# EAGLE design W706X (EAGLE 4.11)
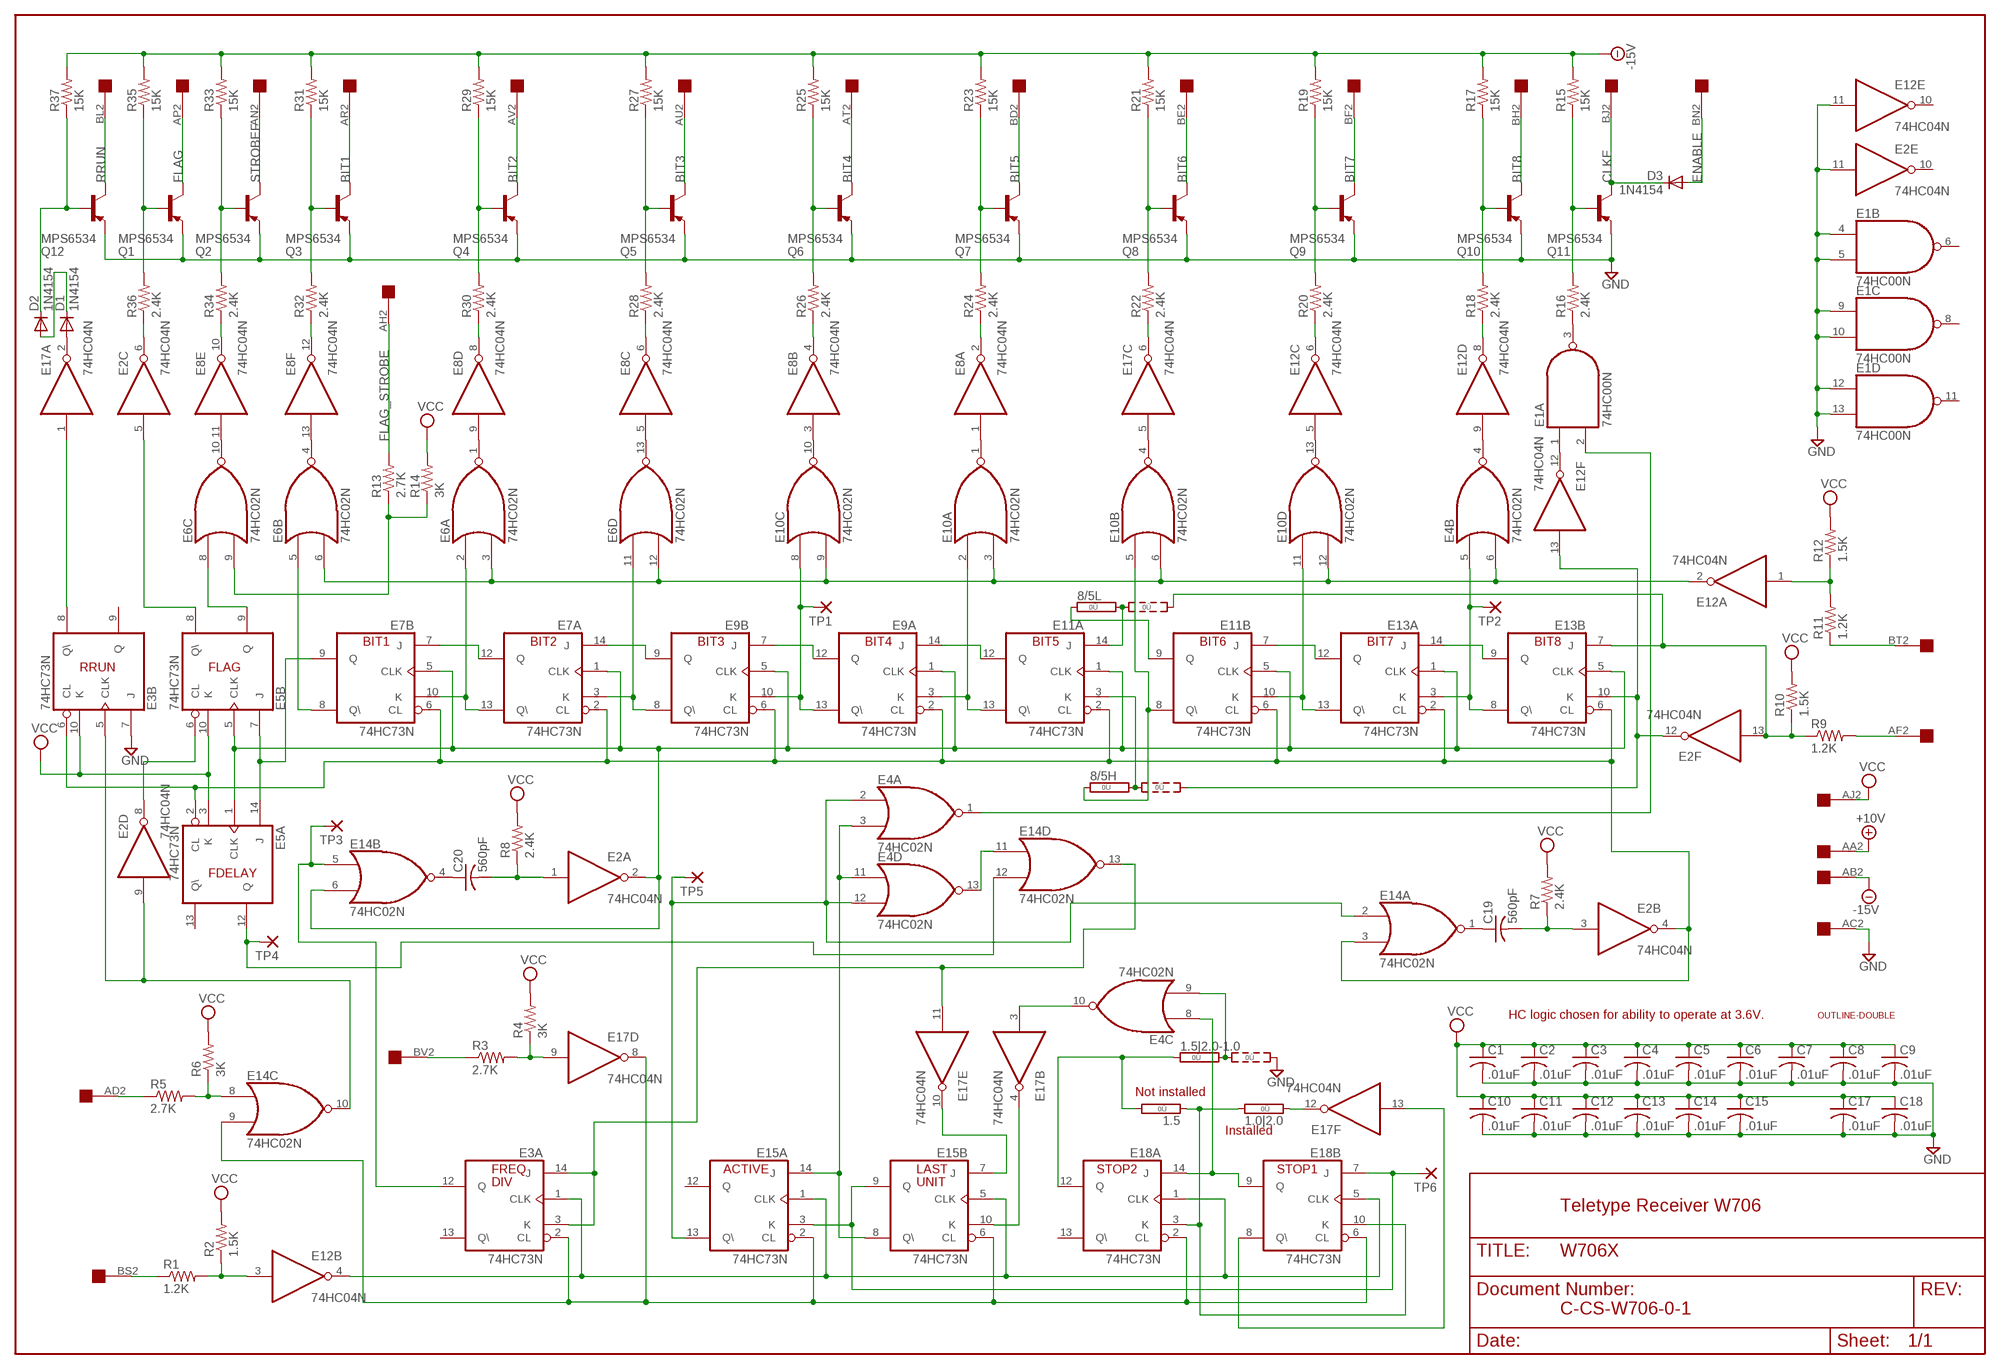
[diagram p0: schematic, sheet 1]

## Parts
1.0|2.0  0R  [0R/10]
1.5  0R  [0R/10]
1.5|2.0-1.0  0R2  [0R2/10]
8/5H  0R2  [0R2/10]
8/5L  0R2  [0R2/10]
C1  .01uF  C-US050-025X075  [C050-025X075]
C2  .01uF  C-US050-025X075  [C050-025X075]
C3  .01uF  C-US050-025X075  [C050-025X075]
C4  .01uF  C-US050-025X075  [C050-025X075]
C5  .01uF  C-US050-025X075  [C050-025X075]
C6  .01uF  C-US050-025X075  [C050-025X075]
C7  .01uF  C-US050-025X075  [C050-025X075]
C8  .01uF  C-US050-025X075  [C050-025X075]
C9  .01uF  C-US050-025X075  [C050-025X075]
C10  .01uF  C-US050-025X075  [C050-025X075]
C11  .01uF  C-US050-025X075  [C050-025X075]
C12  .01uF  C-US050-025X075  [C050-025X075]
C13  .01uF  C-US050-025X075  [C050-025X075]
C14  .01uF  C-US050-025X075  [C050-025X075]
C15  .01uF  C-US050-025X075  [C050-025X075]
C17  .01uF  C-US050-025X075  [C050-025X075]
C18  .01uF  C-US050-025X075  [C050-025X075]
C19  560pF  C-US050-025X075  [C050-025X075]
C20  560pF  C-US050-025X075  [C050-025X075]
D1  1N4154  1N4148  [DO35-10]
D2  1N4154  1N4148  [DO35-10]
D3  1N4154  1N4148  [DO35-10]
E1  74HC00N  74LS00N  [DIL14]
E2  74HC04N  74LS04N  [DIL14]
E3  74HC73N  74LS73N  [DIL14]
E4  74HC02N  74LS02N  [DIL14]
E5  74HC73N  74LS73N  [DIL14]
E6  74HC02N  74LS02N  [DIL14]
E7  74HC73N  74LS73N  [DIL14]
E8  74HC04N  74LS04N  [DIL14]
E9  74HC73N  74LS73N  [DIL14]
E10  74HC02N  74LS02N  [DIL14]
E11  74HC73N  74LS73N  [DIL14]
E12  74HC04N  74LS04N  [DIL14]
E13  74HC73N  74LS73N  [DIL14]
E14  74HC02N  74LS02N  [DIL14]
E15  74HC73N  74LS73N  [DIL14]
E17  74HC04N  74LS04N  [DIL14]
E18  74HC73N  74LS73N  [DIL14]
Q1  MPS6534  2N2904  [TO39]
Q2  MPS6534  2N2904  [TO39]
Q3  MPS6534  2N2904  [TO39]
Q4  MPS6534  2N2904  [TO39]
Q5  MPS6534  2N2904  [TO39]
Q6  MPS6534  2N2904  [TO39]
Q7  MPS6534  2N2904  [TO39]
Q8  MPS6534  2N2904  [TO39]
Q9  MPS6534  2N2904  [TO39]
Q10  MPS6534  2N2904  [TO39]
Q11  MPS6534  2N2904  [TO39]
Q12  MPS6534  2N2904  [TO39]
R1  1.2K  R-US_0207/10  [0207/10]
R2  1.5K  R-US_0207/10  [0207/10]
R3  2.7K  R-US_0207/10  [0207/10]
R4  3K  R-US_0207/10  [0207/10]
R5  2.7K  R-US_0207/10  [0207/10]
R6  3K  R-US_0207/10  [0207/10]
R7  2.4K  R-US_0207/10  [0207/10]
R8  2.4K  R-US_0207/10  [0207/10]
R9  1.2K  R-US_0207/10  [0207/10]
R10  1.5K  R-US_0207/10  [0207/10]
R11  1.2K  R-US_0207/10  [0207/10]
R12  1.5K  R-US_0207/10  [0207/10]
R13  2.7K  R-US_0207/10  [0207/10]
R14  3K  R-US_0207/10  [0207/10]
R15  15K  R-US_0207/10  [0207/10]
R16  2.4K  R-US_0207/10  [0207/10]
R17  15K  R-US_0207/10  [0207/10]
R18  2.4K  R-US_0207/10  [0207/10]
R19  15K  R-US_0207/10  [0207/10]
R20  2.4K  R-US_0207/10  [0207/10]
R21  15K  R-US_0207/10  [0207/10]
R22  2.4K  R-US_0207/10  [0207/10]
R23  15K  R-US_0207/10  [0207/10]
R24  2.4K  R-US_0207/10  [0207/10]
R25  15K  R-US_0207/10  [0207/10]
R26  2.4K  R-US_0207/10  [0207/10]
R27  15K  R-US_0207/10  [0207/10]
R28  2.4K  R-US_0207/10  [0207/10]
R29  15K  R-US_0207/10  [0207/10]
R30  2.4K  R-US_0207/10  [0207/10]
R31  15K  R-US_0207/10  [0207/10]
R32  2.4K  R-US_0207/10  [0207/10]
R33  15K  R-US_0207/10  [0207/10]
R34  2.4K  R-US_0207/10  [0207/10]
R35  15K  R-US_0207/10  [0207/10]
R36  2.4K  R-US_0207/10  [0207/10]
R37  15K  R-US_0207/10  [0207/10]
TP1  3,17/1,3  [3,17/1,3]
TP2  3,17/1,3  [3,17/1,3]
TP3  3,17/1,3  [3,17/1,3]
TP4  3,17/1,3  [3,17/1,3]
TP5  3,17/1,3  [3,17/1,3]
TP6  3,17/1,3  [3,17/1,3]
U$1  OUTLINE-DOUBLE  [DOUBLE]
U$2  DOUBLE  [EDGE-CON4]

## Nets
+10V [Supply]: U$2.AA2
-15V [Supply]: R15.2 R17.2 R19.2 R21.2 R23.2 R25.2 R27.2 R29.2 R31.2 R33.2 R35.2 R37.2 U$2.AB2
BIT1: Q3.3(C) U$2.AR2
BIT2: Q4.3(C) U$2.AV2
BIT3: Q5.3(C) U$2.AU2
BIT4: Q6.3(C) U$2.AT2
BIT5: Q7.3(C) U$2.BD2
BIT6: Q8.3(C) U$2.BE2
BIT7: Q9.3(C) U$2.BF2
BIT8: Q10.3(C) U$2.BH2
CLKE: D3.C Q11.3(C) U$2.BJ2
ENABLE: D3.A U$2.BN2
FLAG: Q1.3(C) U$2.AP2
FLAG_STROBE: R13.2 U$2.AH2
GND [Supply]: 1.5|2.0-1.0.3 C1.2 C2.2 C3.2 C4.2 C5.2 C6.2 C7.2 C8.2 C9.2 C10.2 C11.2 C12.2 C13.2 C14.2 C15.2 C17.2 C18.2 E1.4(B:I0) E1.5(B:I1) E1.9(C:I0) E1.10(C:I1) E1.12(D:I0) E1.13(D:I1) E2.11(E:I) E3.7(B:J) E12.11(E:I) Q1.1(E) Q2.1(E) Q3.1(E) Q4.1(E) Q5.1(E) Q6.1(E) Q7.1(E) Q8.1(E) Q9.1(E) Q10.1(E) Q11.1(E) Q12.1(E) U$2.AC2
N$1: E6.1(A:O) E8.9(D:I)
N$2: E6.4(B:O) E8.13(F:I)
N$3: E6.10(C:O) E8.11(E:I)
N$4: E6.13(D:O) E8.5(C:I)
N$5: E8.1(A:I) E10.1(A:O)
N$6: E10.4(B:O) E17.5(C:I)
N$7: E10.13(D:O) E12.5(C:I)
N$8: E8.3(B:I) E10.10(C:O)
N$9: E4.4(B:O) E12.9(D:I)
N$10: D1.A E17.2(A:O)
N$11: D1.C D2.A
N$12: D2.C Q12.2(B) R37.1
N$13: E1.3(A:O) R16.1
N$14: E12.8(D:O) R18.1
N$15: E12.6(C:O) R20.1
N$16: E17.6(C:O) R22.1
N$17: E8.2(A:O) R24.1
N$18: E8.4(B:O) R26.1
N$19: E8.6(C:O) R28.1
N$20: E8.8(D:O) R30.1
N$21: E8.12(F:O) R32.1
N$22: E2.6(C:O) R36.1
N$23: Q1.2(B) R35.1 R36.2
N$24: E8.10(E:O) R34.1
N$25: Q2.2(B) R33.1 R34.2
N$26: Q3.2(B) R31.1 R32.2
N$27: Q4.2(B) R29.1 R30.2
N$28: Q5.2(B) R27.1 R28.2
N$29: Q6.2(B) R25.1 R26.2
N$30: Q7.2(B) R23.1 R24.2
N$31: Q8.2(B) R21.1 R22.2
N$32: Q9.2(B) R19.1 R20.2
N$33: Q10.2(B) R17.1 R18.2
N$34: Q11.2(B) R15.1 R16.2
N$35: E3.8(B:Q\) E17.1(A:I)
N$36: E2.5(C:I) E5.8(B:Q\)
N$37: E5.9(B:Q) E6.8(C:I0)
N$38: E7.7(B:J) E7.12(A:Q)
N$39: E6.2(A:I0) E7.10(B:K) E7.13(A:Q\)
N$40: E2.2(A:O) E5.1(A:CLK) E5.5(B:CLK) E7.1(A:CLK) E7.5(B:CLK) E9.1(A:CLK) E9.5(B:CLK) E11.1(A:CLK) E11.5(B:CLK) E13.1(A:CLK) E13.5(B:CLK) E14.6(B:I1)
N$41: E2.4(B:O) E3.6(B:CL) E5.2(A:CL) E7.2(A:CL) E7.6(B:CL) E9.2(A:CL) E9.6(B:CL) E11.2(A:CL) E11.6(B:CL) E13.2(A:CL) E13.6(B:CL) E14.3(A:I1)
N$42: E6.11(D:I0) E7.3(A:K) E9.8(B:Q\)
N$43: E7.14(A:J) E9.9(B:Q)
N$44: E9.10(B:K) E9.13(A:Q\) E10.8(C:I0) TP1.1(P)
N$45: E9.7(B:J) E9.12(A:Q)
N$46: E10.11(D:I0) E11.10(B:K) E13.13(A:Q\)
N$47: E11.7(B:J) E13.12(A:Q)
N$48: E9.3(A:K) E10.2(A:I0) E11.13(A:Q\)
N$49: E9.14(A:J) E11.12(A:Q)
N$50: 8/5H.1 E10.5(B:I0) E11.8(B:Q\)
N$51: 8/5L.1 E11.9(B:Q)
N$52: E4.5(B:I0) E13.3(A:K) E13.8(B:Q\) TP2.1(P)
N$53: E13.9(B:Q) E13.14(A:J)
N$54: R1.1 U$2.BS2
N$55: E4.6(B:I1) E6.3(A:I1) E6.6(B:I1) E6.12(D:I1) E10.3(A:I1) E10.6(B:I1) E10.9(C:I1) E10.12(D:I1) E12.2(A:O)
N$56: E6.5(B:I0) E7.8(B:Q\)
N$57: E12.3(B:I) R1.2 R2.1
N$58: R11.1 U$2.BT2
N$59: E12.1(A:I) R11.2 R12.1
N$60: E4.3(A:I1) E4.11(D:I0) E15.8(B:Q\) E15.14(A:J)
N$61: E2.9(D:I) E3.5(B:CLK) E14.10(C:O)
N$62: E4.8(C:I0) E18.9(B:Q) E18.14(A:J)
N$63: E15.3(A:K) E15.9(B:Q) E18.7(B:J) TP6.1(P)
N$64: E1.2(A:I1) E4.1(A:O)
N$65: 8/5L.3 E2.13(F:I) E13.7(B:J) R9.1 R10.1
N$66: 8/5H.2 E11.3(A:K)
N$67: 8/5L.2 E11.14(A:J)
N$68: E14.8(C:I0) R5.2 R6.1
N$69: R9.2 U$2.AF2
N$70: 8/5H.3 E2.12(F:O) E12.13(F:I) E13.10(B:K)
N$71: E6.9(C:I1) R13.1 R14.1
N$72: R5.1 U$2.AD2
N$73: E4.2(A:I0) E4.12(D:I1) E14.2(A:I0) E15.13(A:Q\) TP5.1(P)
N$74: E2.8(D:O) E5.6(B:CL)
N$75: E3.1(A:CLK) E12.4(B:O) E15.1(A:CLK) E15.5(B:CLK) E18.1(A:CLK) E18.5(B:CLK)
N$76: 1.5|2.0-1.0.2 E4.9(C:I1)
N$77: E17.9(D:I) R3.2 R4.1
N$78: R3.1 U$2.BV2
N$79: E4.10(C:O) E17.3(B:I)
N$80: E3.2(A:CL) E14.9(C:I1) E15.2(A:CL) E15.6(B:CL) E17.8(D:O) E18.2(A:CL) E18.6(B:CL)
N$81: 1.0|2.0.2 1.5.1 E18.3(A:K) E18.10(B:K)
N$82: 1.5.2 1.5|2.0-1.0.1 E18.12(A:Q)
N$83: E15.10(B:K) E17.4(B:O)
N$84: E4.13(D:O) E14.11(D:I0)
N$85: C20.2 E2.1(A:I) R8.1
N$86: C19.2 E2.3(B:I) R7.1
N$87: C20.1 E14.4(B:O)
N$88: C19.1 E14.1(A:O)
N$89: 1.0|2.0.1 E17.12(F:O)
N$90: E17.13(F:I) E18.8(B:Q\)
N$91: E3.12(A:Q) E14.5(B:I0) TP3.1(P)
N$92: E5.7(B:J) E5.14(A:J) E7.9(B:Q)
N$93: E15.7(B:J) E17.10(E:O)
N$94: E5.12(A:Q) E14.12(D:I1) TP4.1(P)
N$95: E3.3(A:K) E3.14(A:J) E14.13(D:O) E17.11(E:I)
N$96: E1.1(A:I0) E12.12(F:O)
RRUN: Q12.3(C) U$2.BL2
STROBEF: Q2.3(C) U$2.AN2
VCC [Supply]: C1.1 C2.1 C3.1 C4.1 C5.1 C6.1 C7.1 C8.1 C9.1 C10.1 C11.1 C12.1 C13.1 C14.1 C15.1 C17.1 C18.1 E3.10(B:K) E5.3(A:K) E5.10(B:K) R2.2 R4.2 R6.2 R7.2 R8.2 R10.2 R12.2 R14.2 U$2.AJ2
Unconnected: E1.6(B:O) E1.8(C:O) E1.11(D:O) E2.10(E:O) E3.9(B:Q) E3.13(A:Q\) E5.13(A:Q\) E12.10(E:O) E15.12(A:Q) E18.13(A:Q\) U$2.AA1 U$2.AB1 U$2.AC1 U$2.AD1 U$2.AE1 U$2.AE2 U$2.AF1 U$2.AH1 U$2.AJ1 U$2.AK1 U$2.AK2 U$2.AL1 U$2.AL2 U$2.AM1 U$2.AM2 U$2.AN1 U$2.AP1 U$2.AR1 U$2.AS1 U$2.AS2 U$2.AT1 U$2.AU1 U$2.AV1 U$2.BA1 U$2.BA2 U$2.BB1 U$2.BB2 U$2.BC1 U$2.BC2 U$2.BD1 U$2.BE1 U$2.BF1 U$2.BH1 U$2.BJ1 U$2.BK1 U$2.BK2 U$2.BL1 U$2.BM1 U$2.BM2 U$2.BN1 U$2.BP1 U$2.BP2 U$2.BR1 U$2.BR2 U$2.BS1 U$2.BT1 U$2.BU1 U$2.BU2 U$2.BV1

## Notes on the sheet
- BIT1 | BIT2 | BIT3 | BIT4 | BIT5 | BIT6 | BIT7 | BIT8
- RRUN | FLAG
- FDELAY
- HC logic chosen for ability to operate at 3.6V.
- Not installed
- Installed
- FREQ | ACTIVE | LAST | STOP2 | STOP1
- DIV | UNIT
- Teletype Receiver W706
- C-CS-W706-0-1

## Power pins joined to a net without a drawn wire
GND: E1.7(P:GND) E2.7(P:GND) E3.11(P:GND) E4.7(P:GND) E5.11(P:GND) E6.7(P:GND) E7.11(P:GND) E8.7(P:GND) E9.11(P:GND) E10.7(P:GND) E11.11(P:GND) E12.7(P:GND) E13.11(P:GND) E14.7(P:GND) E15.11(P:GND) E17.7(P:GND) E18.11(P:GND)
VCC: E1.14(P:VCC) E2.14(P:VCC) E3.4(P:VCC) E4.14(P:VCC) E5.4(P:VCC) E6.14(P:VCC) E7.4(P:VCC) E8.14(P:VCC) E9.4(P:VCC) E10.14(P:VCC) E11.4(P:VCC) E12.14(P:VCC) E13.4(P:VCC) E14.14(P:VCC) E15.4(P:VCC) E17.14(P:VCC) E18.4(P:VCC)

## Library data of the parts
1.0|2.0 1.5 = jumper:0R: Bridge 0R 10mm
1.5|2.0-1.0 8/5H 8/5L = jumper:0R2: Bridge switch 0R 2 x 10mm
C1-C15 C17-C20 = rcl:C-US: CAPACITOR, American symbol
D1-D3 = diode:1N4148: DIODE high speed (Philips)
E1 = 74xx-us:74*00: Quad 2-input NAND gate
E2 E8 E12 E17 = 74xx-us:74*04: Hex INVERTER
E3 E5 E7 E9 E11 E13 E15 E18 = 74xx-us:74*73: Dual J-K FLIP FLOP, clear
E4 E6 E10 E14 = 74xx-us:74*02: Quad 2-input NOR gate
Q1-Q12 = transistor-pnp:2N2904*: PNP Transistror
R1-R37 = rcl:R-US_: RESISTOR, American symbol
TP1-TP6 = wirepad:3,17/1,3: THROUGH-HOLE PAD
U$1 = dec-con:OUTLINE-*: Board outlines for DEC boards.
U$2 = dec-con:DOUBLE: Double-Height DEC board

## Net classes
1 Supply: width 0.813 mm

## Board
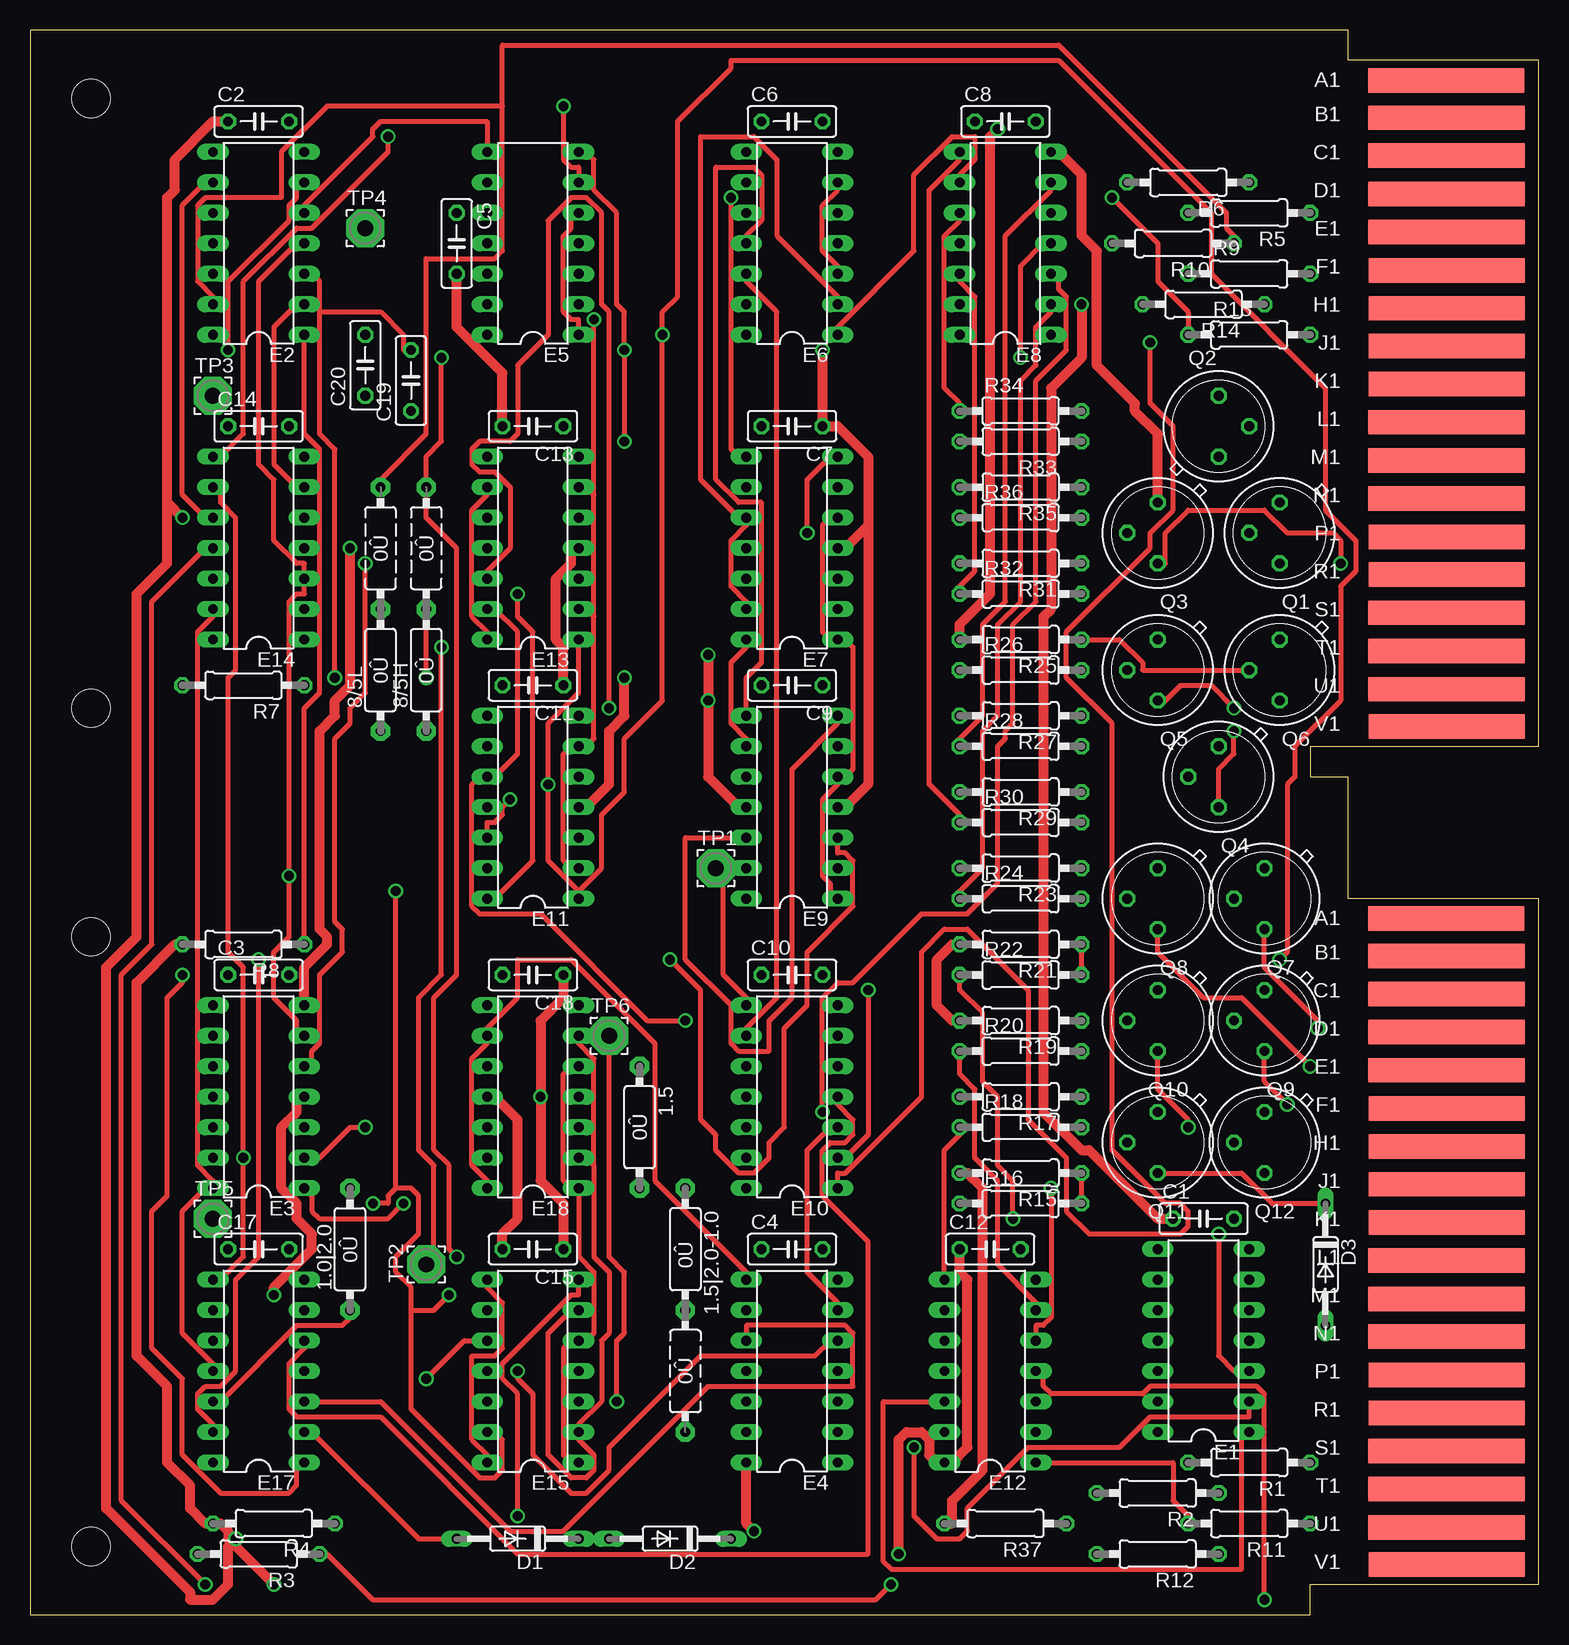
[diagram p1: board, top side]
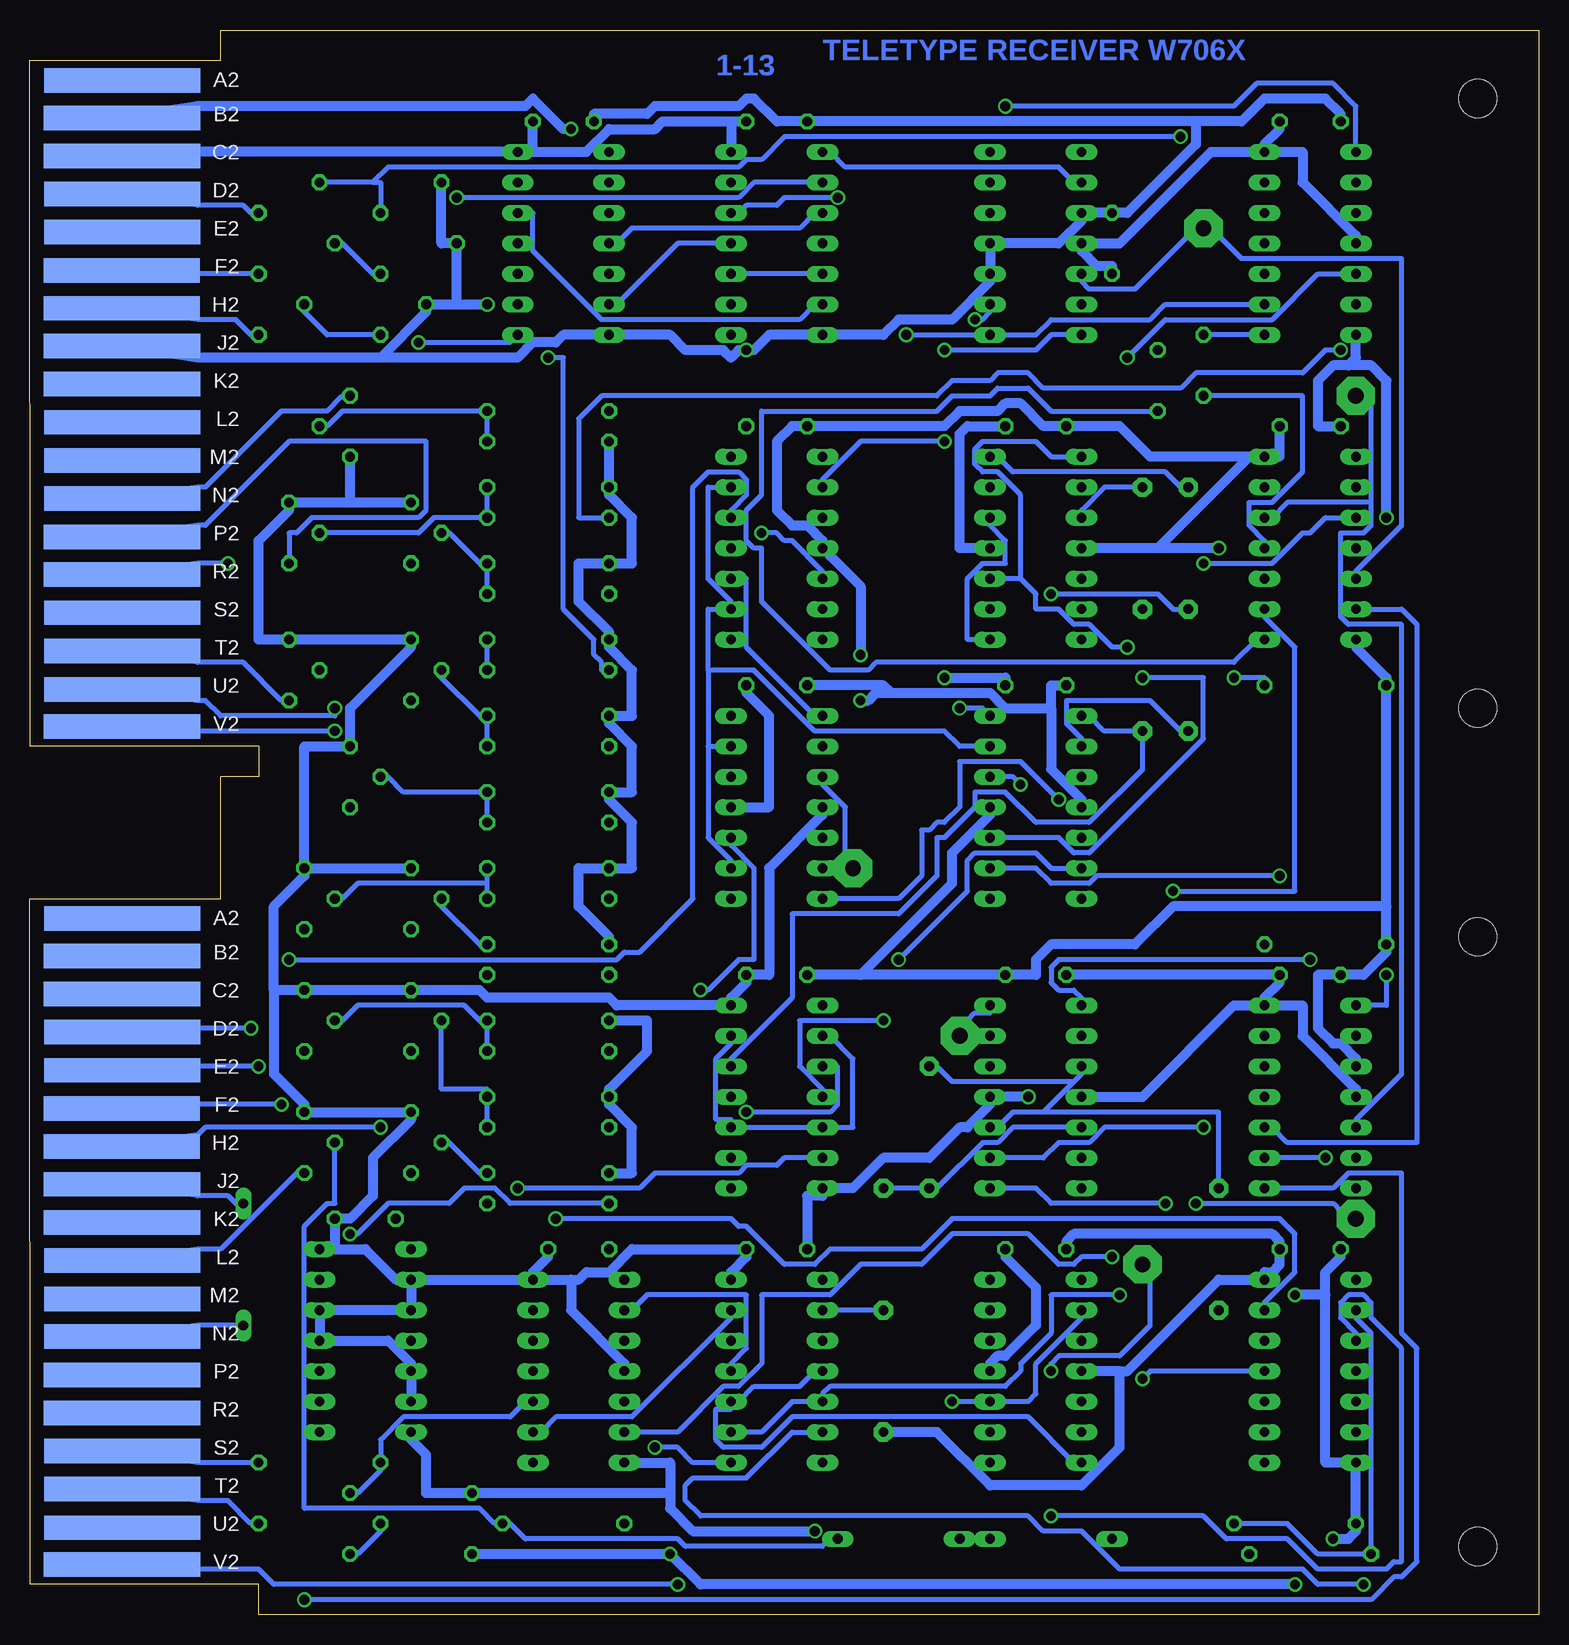
[diagram p2: board, bottom side, seen from below]

Size 125.73 x 132.08 mm. Coordinates in mm from the lower left corner, seen from the top.
Copper layers (1+16): Top 0.035mm / dielectric 1.5mm / Bottom 0.035mm
Design rules "16mils": minimum track width 16mil, minimum drill 32mil, track to track 15mil, track to pad 10mil, pad to pad 10mil, via to via 10mil, smd to smd 10mil, copper to edge 25mil, drill to drill 10mil, minimum pad ring 10mil, minimum via ring 8mil, stop-mask expansion 0mil, vias tented up to drill 0mil, thermal gap 10mil

### Footprints (pad centres in the part's own frame; a part is rotated, then mirrored left to right if it is on the bottom)
0R/10 = drill 0.813 pad 1.6 octagon: 1 -5.08,0; 2 5.08,0
0R2/10 = drill 0.813 pad 1.6 octagon: 1 -5.08,0; 2 5.08,0; 3 15.24,0
C050-025X075 = drill 0.813 octagon: 1 -2.54,0; 2 2.54,0
DO35-10 = drill 0.813 long: A 5.08,0; C -5.08,0
DIL14 = drill 0.813 long: 1 -7.62,-3.81; 2 -5.08,-3.81; 3 -2.54,-3.81; 4 0,-3.81; 5 2.54,-3.81; 6 5.08,-3.81; 7 7.62,-3.81; 8 7.62,3.81; 9 5.08,3.81; 10 2.54,3.81; 11 0,3.81; 12 -2.54,3.81; 13 -5.08,3.81; 14 -7.62,3.81
TO39 = drill 0.813 octagon: 1 0,-2.54; 2 2.54,0; 3 0,2.54
0207/10 = drill 0.813 octagon: 1 -5.08,0; 2 5.08,0
3,17/1,3 = drill 1.321 pad 3.175 octagon: 1 0,0
DOUBLE = hole 3.175: 120.65,56.515; 120.65,5.715; 120.65,75.565; 120.65,126.365
EDGE-CON4 = smd 13.017 x 2.032: AA1 7.709,4.207; AB1 7.684,7.312; AC1 7.684,10.474; AD1 7.684,13.665; AE1 7.693,16.84; AF1 7.668,20.041; AH1 7.668,23.19; AJ1 7.668,26.34; AK1 7.668,29.515; AL1 7.693,32.69; AM1 7.693,35.89; AN1 7.693,39.04; AP1 7.668,42.24; AR1 7.668,45.39; AS1 7.693,48.565; AT1 7.693,51.74; AU1 7.693,54.94; AV1 7.668,58.026; BA1 7.709,74.057; BB1 7.684,77.162; BC1 7.684,80.324; BD1 7.684,83.515; BE1 7.693,86.69; BF1 7.668,89.891; BH1 7.668,93.04; BJ1 7.668,96.19; BK1 7.668,99.365; BL1 7.693,102.54; BM1 7.693,105.74; BN1 7.693,108.89; BP1 7.668,112.09; BR1 7.668,115.24; BS1 7.693,118.415; BT1 7.693,121.59; BU1 7.693,124.79; BV1 7.668,127.876 | smd 13.017 x 2.032 bottom: AA2 7.69,4.207; AB2 7.668,7.328; AC2 7.668,10.49; AD2 7.693,13.665; AE2 7.693,16.84; AF2 7.642,20.041; AH2 7.642,23.19; AJ2 7.668,26.34; AK2 7.668,29.515; AL2 7.693,32.69; AM2 7.693,35.89; AN2 7.693,39.04; AP2 7.668,42.24; AR2 7.668,45.39; AS2 7.693,48.565; AT2 7.693,51.74; AU2 7.693,54.966; AV2 7.668,58.026; BA2 7.69,74.057; BB2 7.668,77.178; BC2 7.668,80.34; BD2 7.693,83.515; BE2 7.693,86.69; BF2 7.642,89.891; BH2 7.642,93.04; BJ2 7.668,96.19; BK2 7.668,99.365; BL2 7.693,102.54; BM2 7.693,105.74; BN2 7.693,108.89; BP2 7.668,112.09; BR2 7.668,115.24; BS2 7.693,118.415; BT2 7.693,121.59; BU2 7.693,124.816; BV2 7.668,127.876

### Placement (x,y rotation side)
1.0|2.0  26.67,30.48 90 top
1.5  50.8,40.64 270 top
1.5|2.0-1.0  54.61,30.48 270 top
8/5H  33.02,78.74 90 top
8/5L  29.21,78.74 90 top
C1  97.79,33.02 0 top
C2  19.05,124.46 0 top
C3  19.05,53.34 0 top
C4  63.5,30.48 0 top
C5  35.56,114.3 270 top
C6  63.5,124.46 0 top
C7  63.5,99.06 180 top
C8  81.28,124.46 0 top
C9  63.5,77.47 180 top
C10  63.5,53.34 0 top
C11  41.91,77.47 180 top
C12  80.01,30.48 0 top
C13  41.91,99.06 180 top
C14  19.05,99.06 0 top
C15  41.91,30.48 180 top
C17  19.05,30.48 0 top
C18  41.91,53.34 180 top
C19  31.75,102.87 90 top
C20  27.94,104.14 90 top
D1  40.64,6.35 180 top
D2  53.34,6.35 180 top
D3  107.95,29.21 270 top
E1  97.79,22.86 90 top
E2  19.05,114.3 90 top
E3  19.05,43.18 90 top
E4  63.5,20.32 90 top
E5  41.91,114.3 90 top
E6  63.5,114.3 90 top
E7  63.5,88.9 90 top
E8  81.28,114.3 90 top
E9  63.5,67.31 90 top
E10  63.5,43.18 90 top
E11  41.91,67.31 90 top
E12  80.01,20.32 90 top
E13  41.91,88.9 90 top
E14  19.05,88.9 90 top
E15  41.91,20.32 90 top
E17  19.05,20.32 90 top
E18  41.91,43.18 90 top
Q1  104.14,90.17 180 top
Q2  99.06,99.06 0 top
Q3  93.98,90.17 180 top
Q4  99.06,69.85 180 top
Q5  93.98,78.74 180 top
Q6  104.14,78.74 180 top
Q7  102.87,59.69 180 top
Q8  93.98,59.69 180 top
Q9  102.87,49.53 180 top
Q10  93.98,49.53 180 top
Q11  93.98,39.37 180 top
Q12  102.87,39.37 180 top
R1  101.6,12.7 180 top
R2  93.98,10.16 180 top
R3  19.05,5.08 180 top
R4  20.32,7.62 180 top
R5  101.6,116.84 180 top
R6  96.52,119.38 180 top
R7  17.78,77.47 180 top
R8  17.78,55.88 180 top
R9  101.6,111.76 0 top
R10  95.25,114.3 180 top
R11  101.6,7.62 180 top
R12  93.98,5.08 180 top
R13  101.6,106.68 0 top
R14  97.79,109.22 180 top
R15  82.55,36.83 180 top
R16  82.55,34.29 0 top
R17  82.55,43.18 180 top
R18  82.55,40.64 0 top
R19  82.55,49.53 180 top
R20  82.55,46.99 0 top
R21  82.55,55.88 180 top
R22  82.55,53.34 0 top
R23  82.55,62.23 180 top
R24  82.55,59.69 0 top
R25  82.55,81.28 180 top
R26  82.55,78.74 0 top
R27  82.55,74.93 180 top
R28  82.55,72.39 0 top
R29  82.55,68.58 180 top
R30  82.55,66.04 0 top
R31  82.55,87.63 180 top
R32  82.55,85.09 0 top
R33  82.55,97.79 180 top
R34  82.55,100.33 0 top
R35  82.55,93.98 180 top
R36  82.55,91.44 0 top
R37  81.28,7.62 180 top
TP1  57.15,62.23 0 top
TP2  33.02,29.21 90 top
TP3  15.24,101.6 0 top
TP4  27.94,115.57 0 top
TP5  15.24,33.02 0 top
TP6  48.26,48.26 0 top
U$1  125.73,132.08 180 top
U$2  125.73,132.08 180 top

### Tracks (layer width: path | path; a pad name or v marks a point on that pad's centre or on a via)
-15V  (via drill 0.81)
  Top 0.813: R37.2 76.83,7.62 76.83,9.53 79.38,12.06 79.38,35.56 78.11,36.83 R15.2 | v80.64,123.83 80.01,123.19 80.01,85.09 77.47,82.55 R25.2 | R19.2 76.83,49.53 75.56,50.8 75.56,54.61 76.83,55.88 R21.2
  Bottom 0.813: R19.2 74.3,49.53 74.3,46.99 77.47,43.81 R17.2 77.47,42.55 75.56,40.64 75.56,36.83 R15.2 | R33.2 R35.2 77.47,93.34 75.56,91.44 75.56,87.63 R31.2 80.01,87.63 80.01,84.45 77.47,81.92 R25.2 77.47,80.64 75.56,78.74 75.56,74.93 R27.2 77.47,74.3 75.56,72.39 75.56,68.58 R29.2 77.47,67.94 75.56,66.04 75.56,62.23 R23.2 80.01,62.23 80.01,59.05 77.47,56.52 R21.2 | v80.64,123.83 81.28,123.83 83.82,126.36 84.45,125.73 111.76,125.73 U$2.AB2
BIT1  (via drill 0.81)
  Top 0.406: v109.22,87.63 109.22,89.53 108.58,90.17 104.78,90.17 102.87,92.08 96.52,92.08 94.61,90.17 94.61,87.63 Q3.3
  Bottom 0.406: v109.22,87.63 111.76,87.63 U$2.AR2
BIT2  (via drill 0.81)
  Top 0.406: v100.33,73.66 100.33,71.75 99.06,70.48 Q4.3
  Bottom 0.406: v100.33,73.66 111.76,73.66 U$2.AV2
BIT3  (via drill 0.81)
  Top 0.406: v100.33,75.56 98.42,77.47 95.89,77.47 94.61,76.2 Q5.3
  Bottom 0.406: v100.33,75.56 100.33,74.93 109.86,74.93 111.12,76.2 111.76,76.2 U$2.AU2
BIT4
  Bottom 0.406: Q6.3 104.78,76.2 107.95,79.38 111.76,79.38 U$2.AT2
BIT5  (via drill 0.81)
  Top 0.406: v107.31,48.9 107.31,49.53 102.87,53.98 Q7.3
  Bottom 0.406: v107.31,48.9 111.76,48.9 U$2.BD2
BIT6  (via drill 0.81)
  Top 0.406: Q8.3 93.98,55.24 97.79,51.44 100.97,51.44 v106.68,45.72
  Bottom 0.406: v106.68,45.72 111.76,45.72 U$2.BE2
BIT7  (via drill 0.81)
  Top 0.406: v104.78,42.55 102.87,44.45 Q9.3
  Bottom 0.406: v104.78,42.55 111.76,42.55 U$2.BF2
BIT8  (via drill 0.81)
  Top 0.406: v96.52,40.64 96.52,41.27 93.98,43.81 Q10.3
  Bottom 0.406: v96.52,40.64 111.12,40.64 111.76,40.01 U$2.BH2
CLKE
  Top 0.406: Q11.3 100.97,36.83 103.5,34.29 D3.C
  Bottom 0.406: D3.C 108.58,34.29 109.22,34.92 111.76,34.92 U$2.BJ2
ENABLE
  Bottom 0.406: D3.A 111.76,24.13 U$2.BN2
FLAG
  Bottom 0.406: Q1.3 104.14,90.17 103.5,90.17 102.23,91.44 93.34,91.44 92.71,92.08 92.71,97.79 104.14,97.79 111.12,90.81 111.76,90.81 U$2.AP2
FLAG_STROBE
  Bottom 0.406: R13.2 107.31,106.68 108.58,107.95 111.76,107.95 U$2.AH2
GND  (via drill 0.81)
  Top 0.813: E18.11 38.73,43.18 40.64,41.27 40.64,33.02 39.37,31.75 C15.2 | C5.2 35.56,107.31 39.37,103.5 C13.2 | v26.67,88.9 26.67,77.47 25.4,76.2 25.4,74.93 24.13,73.66 24.13,57.15 24.77,56.52 24.77,55.88 22.86,53.98 E3.7 | E9.11 59.05,67.31 56.52,69.85 v56.52,76.2 v56.52,80.01 | E8.7 85.72,121.92 87.63,120.02 87.63,114.94 88.9,113.67 88.9,104.14 92.08,100.97 92.08,100.33 93.98,98.42 Q3.1
  Bottom 0.813: C18.2 C3.2 21.59,52.7 22.86,51.44 E3.7 | E3.11 15.24,43.81 19.68,48.26 19.68,50.8 E3.7 | E18.11 33.02,43.18 25.4,50.8 E3.7 | 34.92,20.32 34.29,20.32 26.67,27.94 E17.7 22.86,28.57 22.23,28.57 21.59,29.21 C17.2 21.59,31.11 22.23,31.75 38.73,31.75 39.37,31.11 C15.2 | 34.92,20.32 E15.11 | 34.92,20.32 34.92,13.97 38.1,10.79 45.72,10.79 50.16,15.24 1.5|2.0-1.0.3 | C5.2 35.56,112.39 36.83,112.39 38.1,113.67 E5.11 34.92,114.3 27.3,121.92 E2.7 | E2.11 15.24,114.94 19.68,119.38 19.68,121.92 E2.7 | C2.2 21.59,123.83 22.86,122.56 E2.7 | 31.75,88.9 24.13,96.52 | 31.75,88.9 E13.11 | 24.13,96.52 E14.7 21.59,96.52 C14.2 | 24.13,96.52 32.38,96.52 34.92,99.06 C13.2 41.27,99.06 43.18,100.97 44.45,100.97 45.09,100.33 48.26,100.33 49.53,99.06 C7.2 62.23,99.06 63.5,97.79 63.5,92.08 62.23,90.81 60.96,90.81 59.69,89.53 E7.11 59.05,88.9 59.05,88.27 56.52,85.72 v56.52,80.01 | v26.67,88.9 31.75,88.9 | 67.31,124.46 E6.7 | 67.31,124.46 C6.2 | U$2.AC2 111.76,121.92 E8.7 83.82,121.92 | 83.82,121.92 C8.2 | 67.31,124.46 73.03,124.46 73.66,123.83 77.47,123.83 79.38,121.92 83.82,121.92 | E1.13 E1.12 93.98,20.95 95.89,22.86 E1.4 E1.5 E1.10 E1.9 | 100.33,30.48 C1.2 99.06,33.02 97.16,34.92 97.16,38.1 93.98,41.27 Q11.1 Q12.1 102.87,42.55 105.41,45.09 105.41,52.07 | 100.33,30.48 E1.7 | E4.7 67.31,28.57 66.04,29.84 C4.2 75.56,30.48 77.47,28.57 79.38,28.57 80.01,27.94 80.64,27.94 | 80.64,27.94 80.64,25.4 76.2,20.95 E12.11 | E12.7 80.64,27.94 | C12.2 82.55,29.84 83.82,28.57 E12.7 | E1.9 E12.7 | 100.33,30.48 97.79,30.48 95.25,27.94 E1.9 | 99.06,92.71 Q3.1 | 99.06,92.71 Q1.1 104.14,92.08 106.68,89.53 106.68,81.28 Q6.1 Q5.1 93.98,80.64 99.06,75.56 Q4.1 102.87,72.39 Q7.1
  Bottom 0.813: 99.06,92.71 Q2.1 | Q7.1 Q8.1 | 40.64,75.56 40.64,77.47 C11.2 | 40.64,75.56 40.64,70.48 38.1,67.94 E11.11 | 53.98,76.83 54.61,77.47 C9.2 | 53.98,76.83 45.72,76.83 44.45,75.56 40.64,75.56 | E9.11 59.69,66.67 64.14,62.23 64.14,53.34 C10.2 66.04,52.7 67.31,51.44 E10.7 76.83,50.8 77.47,51.44 87.63,51.44 88.27,52.07 Q10.1 Q9.1 105.41,52.07 | 53.98,76.83 55.24,76.83 55.88,76.2 v56.52,76.2 | 105.41,52.07 105.41,59.05 102.87,61.59 Q7.1
N$1
  Top 0.406: E6.1 67.31,107.31 73.66,113.67 73.66,120.02 76.83,123.19 78.74,123.19 78.74,121.28 77.47,120.02 E8.9
N$2
  Bottom 0.406: E8.13 76.83,109.22 71.75,114.3 E6.4
N$3
  Bottom 0.406: E6.10 60.33,116.84 61.59,115.57 75.56,115.57 76.83,114.3 E8.11
N$4
  Bottom 0.406: E6.13 60.33,109.22 61.59,107.95 78.11,107.95 83.82,113.67 83.82,116.84 E8.5
N$5  (via drill 0.81)
  Top 0.406: v93.34,106.05 93.34,100.97 95.25,99.06 95.25,92.08 93.34,90.17 93.34,88.9 86.36,81.92 86.36,78.11 90.17,74.3 90.17,38.73 94.61,34.29 95.89,34.29 96.52,33.66 96.52,32.38 95.89,31.75 88.27,31.75 86.36,33.66 86.36,38.1 83.19,41.27 83.19,52.07 78.11,57.15 76.2,57.15 74.3,55.24 74.3,43.18 67.94,36.83 67.31,36.83 E10.1
  Bottom 0.406: v93.34,106.05 85.72,106.05 85.72,106.68 E8.1
N$6
  Top 0.406: E17.5 22.86,22.23 21.59,20.95 21.59,17.14 22.23,16.51 29.21,16.51 40.64,5.08 69.85,5.08 69.85,31.11 66.04,34.92 66.04,38.73 66.67,39.37 67.94,39.37 68.58,40.01 68.58,41.27 67.31,42.55 E10.4
N$7  (via drill 0.81)
  Top 0.406: v85.09,35.56 85.09,24.77 84.45,24.13 83.82,24.13 E12.5
  Bottom 0.406: v85.09,35.56 74.93,35.56 73.66,36.83 66.67,36.83 66.04,37.47 63.5,37.47 62.87,38.1 E10.13
N$8  (via drill 0.81)
  Top 0.406: v66.04,41.91 66.04,51.44 67.31,52.7 68.58,52.7 74.3,58.42 78.11,58.42 80.64,60.96 80.64,72.39 81.28,73.03 81.28,73.66 81.92,74.3 81.92,82.55 83.82,84.45 83.82,102.87 86.36,105.41 86.36,109.86 85.72,110.49 85.72,111.76 E8.3
  Bottom 0.406: v66.04,41.91 59.05,41.91 58.42,42.55 58.42,45.72 E10.10
N$9
  Bottom 0.406: E4.4 67.31,20.95 66.04,22.23 66.04,26.67 74.3,26.67 75.56,25.4 E12.9
N$10
  Top 0.406: E17.2 23.5,15.24 32.38,6.35 D1.A
N$11
  Bottom 0.406: D1.C D2.A
N$12
  Bottom 0.406: D2.C 59.05,6.35 59.69,5.71 71.12,5.71 71.75,6.35 84.45,6.35 85.72,7.62 R37.1 87,7.62 88.27,8.89 102.87,8.89 102.87,32.38 100.97,34.29 100.33,34.29 Q12.2
N$13  (via drill 0.81)
  Top 0.406: v99.06,31.75 99.06,21.59 100.33,20.32 E1.3
  Bottom 0.406: v99.06,31.75 98.42,31.75 95.89,34.29 90.81,34.29 89.53,35.56 87,35.56 85.72,34.29 R16.1
N$14
  Top 0.406: E12.8 76.2,38.73 77.47,40.01 R18.1
N$15
  Top 0.406: E12.6 83.82,26.04 80.64,29.21 80.64,36.2 78.74,38.1 78.74,43.81 77.47,45.09 R20.1
N$16  (via drill 0.81)
  Top 0.406: v81.92,33.02 81.92,36.2 80.64,37.47 80.64,43.18 79.38,44.45 79.38,50.16 77.47,52.07 R22.1
  Bottom 0.406: v81.92,33.02 67.31,33.02 66.67,32.38 66.04,32.38 62.87,29.21 60.33,29.21 59.05,30.48 51.44,30.48 48.9,33.02 21.59,33.02 20.32,31.75 20.32,28.57 22.86,26.04 E17.6
N$17
  Top 0.406: R24.1 77.47,60.33 79.38,62.23 79.38,73.66 80.64,74.93 80.64,82.55 82.55,84.45 82.55,102.87 83.82,104.14 83.82,107.31 85.09,108.58 E8.2
N$18  (via drill 0.81)
  Top 0.406: v82.55,104.78 82.55,112.39 84.45,114.3 E8.4
  Bottom 0.406: v82.55,104.78 81.28,104.78 81.28,83.82 78.74,81.28 78.74,80.01 78.11,79.38 78.11,78.74 R26.1
N$19
  Top 0.406: R28.1 77.47,73.03 79.38,74.93 79.38,82.55 81.28,84.45 81.28,114.94 85.09,118.75 E8.6
N$20
  Top 0.406: R30.1 77.47,66.67 74.93,69.22 74.93,118.75 77.47,121.28 E8.8
N$21
  Top 0.406: R32.1 77.47,85.72 78.74,87 78.74,109.86 77.47,111.12 E8.12
N$22  (via drill 0.81)
  Top 0.406: v16.51,105.41 16.51,111.12 21.59,116.2 21.59,117.47 22.23,118.11 22.23,119.38 E2.6
  Bottom 0.406: v16.51,105.41 17.78,105.41 19.68,103.5 28.57,103.5 29.84,102.23 41.27,102.23 42.55,103.5 45.09,103.5 45.72,102.87 48.9,102.87 50.16,101.6 78.11,101.6 80.01,99.69 80.01,91.44 R36.1
N$23
  Bottom 0.406: R35.1 R36.2 92.08,91.44 93.34,90.17 Q1.2
N$24
  Top 0.406: R34.1 77.47,100.97 76.2,102.23 76.2,114.94 77.47,116.2 E8.10
N$25
  Bottom 0.406: R33.1 R34.2 99.69,100.33 100.97,99.06 Q2.2
N$26
  Bottom 0.406: R32.2 R31.1 88.27,87.63 90.81,90.17 Q3.2
N$27
  Bottom 0.406: R30.2 R29.1 94.61,68.58 95.89,69.85 Q4.2
N$28
  Bottom 0.406: R28.2 R27.1 88.27,74.93 91.44,78.11 Q5.2
N$29
  Top 0.406: Q6.2 92.71,78.74 92.71,79.38 90.81,81.28 R25.1
  Bottom 0.406: R26.2 R25.1
N$30
  Bottom 0.406: R24.2 87.63,60.96 | 87.63,60.96 R23.1 | 87.63,60.96 98.42,60.96 99.69,59.69 Q7.2
N$31
  Top 0.406: R22.2 R21.1
  Bottom 0.406: Q8.2 91.44,59.05 88.27,55.88 R21.1
N$32
  Bottom 0.406: R20.2 R19.1 88.27,49.53 89.53,50.8 98.42,50.8 99.69,49.53 Q9.2
N$33
  Bottom 0.406: R18.2 R17.1 87.63,43.81 91.44,43.81 Q10.2
N$34
  Top 0.406: R16.2 R15.1
  Bottom 0.406: Q11.2 90.81,39.37 88.27,36.83 R15.1
N$35  (via drill 0.81)
  Top 0.406: v12.7,53.34 12.7,52.7 11.43,51.44 11.43,34.92 10.16,33.66 10.16,22.23 12.7,19.68 12.7,13.34 15.88,10.16 21.59,10.16 22.23,10.79 22.23,12.7 E17.1
  Bottom 0.406: v12.7,53.34 12.7,50.8 E3.8
N$36
  Top 0.406: E2.5 22.86,117.47 28.57,123.19 28.57,123.83 29.21,124.46 38.1,124.46 E5.8
N$37
  Bottom 0.406: E5.9 38.73,119.38 40.01,120.65 57.78,120.65 59.05,121.92 E6.8
N$38  (via drill 0.81)
  Top 0.406: v64.77,90.17 64.77,94.61 66.67,96.52 E7.7
  Bottom 0.406: v64.77,90.17 63.5,90.17 62.87,89.53 62.23,89.53 59.69,87 E7.12
N$39
  Top 0.406: E7.13 59.69,84.45 58.42,85.72 58.42,89.53 59.69,90.81 E7.10 59.05,91.44 55.88,94.61 55.88,123.19 60.33,123.19 62.23,121.28 62.23,114.94 67.31,109.86 E6.2
N$40  (via drill 0.81)
  Top 0.406: E14.6 22.23,93.98 20.32,95.89 20.32,107.31 22.23,109.22 E2.2 | E5.5 45.09,116.84 45.09,115.57 44.45,114.94 44.45,108.58 45.09,107.95 45.72,107.95 E5.1 | E9.1 66.67,59.69 66.67,60.96 66.04,61.59 66.04,67.94 67.31,69.22 E9.5 67.94,69.85 68.58,70.48 68.58,80.64 67.94,81.28 E7.1 66.67,81.28 66.04,81.92 66.04,90.81 66.67,91.44 E7.5 | 45.72,60.33 43.18,62.87 v43.18,69.22 43.18,74.3 45.72,76.83 E13.1 | v104.14,54.61 104.78,55.24 104.78,69.22 105.41,69.85 105.41,72.39 109.22,76.2 109.22,85.72 110.49,87 110.49,89.53 107.95,92.08 107.95,102.23 98.42,111.76 98.42,116.84 85.72,129.54 58.42,129.54 58.42,128.91 53.98,124.46 53.98,109.86 52.7,108.58 v52.7,106.68 52.7,76.2 49.53,73.03 49.53,68.58 47.62,66.67 47.62,62.23 45.72,60.33 | E11.1 45.72,60.33
  Bottom 0.406: E2.2 31.11,109.22 32.38,107.95 40.64,107.95 41.91,106.68 E5.1 v52.7,106.68 | v43.18,69.22 43.81,69.85 E11.5 | E13.5 45.72,90.81 44.45,89.53 44.45,87.63 46.35,87.63 47.62,86.36 47.62,81.28 E13.1 | v104.14,54.61 76.83,54.61 76.2,55.24 74.93,55.24 70.48,59.69 70.48,93.98 69.22,95.25 66.67,95.25 66.04,94.61 66.04,93.34 67.31,92.08 E7.5
N$41  (via drill 0.81)
  Top 0.406: E3.6 22.23,48.26 22.23,49.53 20.32,51.44 20.32,55.24 21.59,56.52 v21.59,61.59 21.59,84.45 22.23,85.09 22.86,85.09 E14.3 22.86,87.63 22.23,87.63 20.32,89.53 20.32,94.61 19.05,95.89 19.05,111.12 22.23,114.3 E2.4 | E11.2 45.09,62.23 44.45,62.87 44.45,71.75 45.09,72.39 E11.6 46.35,72.39 46.99,73.03 46.99,83.19 | 46.99,83.19 46.35,83.82 E13.2 | 46.99,93.34 46.35,93.98 E13.6 | 46.99,83.19 46.99,93.34 | 46.99,93.34 v46.99,107.95
  Bottom 0.406: 69.22,72.39 69.22,64.77 67.31,62.87 E9.2 | 69.22,72.39 E9.6 | E7.6 69.22,93.98 69.22,86.36 67.31,84.45 E7.2 69.22,83.82 69.22,78.74 | 69.22,78.74 69.22,72.39 | v46.99,107.95 46.35,107.95 45.72,108.58 E5.2 | 69.22,78.74 65.41,78.74 60.33,73.66 49.53,73.66 48.26,72.39 E11.6 | v21.59,61.59 36.83,61.59 37.47,60.96 40.64,60.96 41.91,62.23 E11.2
N$42
  Top 0.406: E6.11 59.69,114.94 60.96,116.2 60.96,120.02 60.33,120.65 57.15,120.65 57.15,94.61 59.05,92.71 60.96,92.71 60.96,79.38 59.69,78.11 E9.8
  Bottom 0.406: E9.8 60.33,74.93 66.04,80.64 66.04,86.36 E7.3
N$43
  Top 0.406: E9.9 59.69,73.03 58.42,74.3 58.42,79.38 59.69,80.64 E7.14
N$44
  Top 0.406: E10.8 59.69,51.44 57.78,53.34 57.78,60.96 TP1.1
  Bottom 0.406: E9.13 TP1.1 57.78,63.5 57.78,67.31 59.69,69.22 E9.10
N$45
  Top 0.406: E9.12 54.61,64.77 54.61,54.61 58.42,50.8 58.42,47.62 59.05,46.99 61.59,46.99 61.59,49.53 63.5,51.44 63.5,70.48 67.31,74.3 E9.7
N$46  (via drill 0.81)
  Top 0.406: E13.13 38.73,83.82 40.64,81.92 40.64,71.75 38.73,69.85 E11.10 37.47,69.85 36.83,69.22 36.83,59.05 37.47,58.42 42.55,58.42 51.44,49.53 v54.61,49.53
  Bottom 0.406: v54.61,49.53 61.59,49.53 61.59,45.72 59.69,43.81 E10.11
N$47  (via drill 0.81)
  Top 0.406: v48.26,75.56 48.26,108.58 47.62,109.22 47.62,116.84 46.35,118.11 45.09,118.11 43.18,116.2 43.18,106.68 40.64,104.14 40.64,98.42 40.01,97.79 37.47,97.79 36.83,97.16 36.83,95.89 37.47,95.25 38.73,95.25 40.01,93.98 40.01,88.9 38.1,87 E13.12
  Bottom 0.406: v48.26,75.56 46.35,75.56 46.35,74.93 E11.7
N$48  (via drill 0.81)
  Top 0.406: v69.85,52.07 69.85,40.01 67.94,38.1 E10.2 | v53.34,54.61 55.88,52.07 55.88,41.27 57.15,40.01 57.15,38.73 59.05,36.83 60.33,36.83 61.59,38.1 61.59,39.37 62.87,40.64 62.87,48.9 64.77,50.8 64.77,55.24 68.58,59.05 68.58,62.87 67.94,63.5 67.31,63.5 E9.3
  Bottom 0.406: v69.85,52.07 69.22,52.07 66.67,54.61 65.41,54.61 65.41,62.23 67.31,64.14 E9.3 | v53.34,54.61 47.62,60.33 47.62,62.87 46.99,63.5 41.91,63.5 40.64,62.23 E11.13
N$49  (via drill 0.81)
  Top 0.406: v40.01,67.94 39.37,67.31 39.37,66.67 38.73,66.04 38.1,66.04 E11.12
  Bottom 0.406: v40.01,67.94 43.18,71.12 48.26,71.12 48.26,67.31 49.53,66.04 50.16,66.04 50.8,65.41 51.44,65.41 51.44,61.59 53.34,59.69 E9.14
N$50
  Bottom 0.406: E10.5 67.31,46.35 62.23,51.44 62.23,58.42 53.34,58.42 50.16,61.59 50.16,64.77 49.53,64.77 46.99,67.31 46.99,68.58 44.45,68.58 41.91,66.04 37.47,66.04 33.02,70.48 8/5H.1 36.2,73.66 37.47,74.93 E11.8
N$51
  Bottom 0.406: E11.9 38.1,73.03 39.37,74.3 39.37,76.2 32.38,76.2 29.84,73.66 8/5L.1
N$52  (via drill 0.81)
  Top 0.406: v40.64,20.32 40.64,19.68 41.91,18.41 41.91,13.34 45.09,10.16 46.35,10.16 48.26,12.06 48.26,13.97 55.88,21.59 65.41,21.59 66.67,22.86 E4.5 | v34.29,80.64 34.29,53.34 32.38,51.44 32.38,38.73 33.66,37.47 33.66,30.48 TP2.1
  Bottom 0.406: 43.18,86.36 43.18,93.34 45.09,95.25 46.35,95.25 46.99,95.89 46.99,97.16 46.35,97.79 41.91,97.79 40.64,96.52 E13.8 | 43.18,86.36 E13.3 | v40.64,20.32 40.64,20.95 40.01,21.59 34.92,21.59 32.38,24.13 32.38,27.94 TP2.1 | 43.18,86.36 41.91,85.09 41.91,83.82 40.01,83.82 38.73,82.55 37.47,82.55 35.56,80.64 v34.29,80.64
N$53
  Top 0.406: E13.14 38.1,81.92 36.83,83.19 36.83,92.08 38.1,93.34 E13.9
N$54
  Bottom 0.406: R1.1 111.76,12.7 U$2.BS2
N$55
  Top 0.406: E6.6 67.31,118.75 66.04,117.47 66.04,113.67 67.31,112.39 E6.3 | E6.12 59.69,111.12 62.23,108.58 62.23,51.44 59.69,48.9 E10.9 | E4.6 67.31,26.04 64.77,28.57 64.77,38.73 66.67,40.64 E10.3
  Bottom 0.406: E4.6 67.31,24.77 75.56,16.51 81.92,16.51 83.19,15.24 E12.2 | E6.12 E6.3 | E10.9 59.05,48.26 57.15,46.35 57.15,40.64 E10.12 E10.3 67.31,41.27 68.58,41.27 68.58,46.35 67.31,47.62 E10.6
N$56  (via drill 0.81)
  Top 0.406: v58.42,118.11 58.42,97.16 59.05,96.52 E7.8
  Bottom 0.406: v58.42,118.11 62.87,118.11 63.5,117.47 66.04,117.47 66.67,116.84 E6.5
N$57
  Bottom 0.406: E12.3 84.45,17.78 85.72,16.51 94.61,16.51 96.52,14.61 R1.2 96.52,12.06 98.42,10.16 R2.1
N$58
  Bottom 0.406: R11.1 107.31,7.62 109.22,9.53 111.76,9.53 U$2.BT2
N$59
  Top 0.406: E12.1 95.25,12.7 95.25,9.53 96.52,8.26 R11.2
  Bottom 0.406: R12.1 98.42,5.08 96.52,6.99 R11.2
N$60
  Top 0.406: E15.8 38.1,27.3 39.37,26.04 39.37,22.23 38.73,21.59 36.83,21.59 36.83,14.61 38.1,13.34 E15.14
  Bottom 0.406: E15.14 38.73,12.7 42.55,16.51 62.23,16.51 64.77,13.97 67.94,13.97 68.58,14.61 68.58,17.14 67.31,17.14 E4.3 66.67,17.78 65.41,19.05 61.59,19.05 60.33,20.32 E4.11
N$61  (via drill 0.81)
  Top 0.406: E2.9 14.61,119.38 12.7,117.47 12.7,93.34 14.61,91.44 E14.10 | v27.94,87.63 27.94,76.83 26.67,75.56 26.67,74.3 25.4,73.03 25.4,57.78 26.04,57.15 26.04,55.24 24.13,53.34 24.13,47.62 23.5,46.99 23.5,45.72 E3.5
  Bottom 0.406: v27.94,87.63 22.23,87.63 19.68,90.17 19.05,90.17 17.78,91.44 E14.10
N$62
  Top 0.406: E18.14 38.1,36.2 36.83,37.47 36.83,46.35 38.1,47.62 E18.9 38.1,48.9 40.64,51.44 40.64,54.61 45.09,54.61 52.07,47.62 52.07,36.2 59.69,28.57 E4.8
N$63  (via drill 0.81)
  Top 0.406: v48.9,17.78 48.9,22.86 49.53,23.5 49.53,28.57 48.26,29.84 TP6.1
  Bottom 0.406: E18.7 45.72,50.16 46.99,50.16 47.62,49.53 TP6.1 | E15.9 38.1,24.77 41.91,20.95 41.91,18.41 42.55,17.78 E15.3 v48.9,17.78
N$64  (via drill 0.81)
  Top 0.406: v73.66,13.97 73.66,8.26 75.56,6.35 77.47,6.35 78.11,6.99 78.11,8.89 83.19,13.97 90.81,13.97 93.34,16.51 101.6,16.51 E1.2
  Bottom 0.406: v73.66,13.97 71.75,13.97 70.48,12.7 E4.1
N$65
  Top 0.406: 39.37,125.73 24.77,125.73 20.95,121.92 20.95,118.11 14.61,118.11 13.97,117.47 13.97,111.12 15.24,109.86 E2.13 | 39.37,125.73 39.37,113.67 38.73,113.03 33.02,113.03 33.02,98.42 29.21,94.61 8/5L.3 | 39.37,125.73 39.37,130.81 85.72,130.81 99.69,116.84 99.69,115.57 100.33,114.94 R10.1
  Bottom 0.406: R9.1 97.16,111.76 99.69,114.3 R10.1 | E13.7 45.09,96.52 43.81,95.25 31.11,95.25 29.84,93.98 8/5L.3
N$66  (via drill 0.81)
  Top 0.406: v33.02,78.11 8/5H.2
  Bottom 0.406: v33.02,78.11 27.94,78.11 27.94,73.03 37.47,63.5 38.73,63.5 40.01,64.77 E11.3
N$67  (via drill 0.81)
  Top 0.406: v40.64,85.09 40.64,83.19 41.91,81.92 41.91,62.87 38.73,59.69 E11.14
  Bottom 0.406: v40.64,85.09 31.75,85.09 30.48,83.82 8/5L.2
N$68  (via drill 0.81)
  Top 0.406: v29.84,123.19 29.84,121.92 23.5,115.57 22.23,115.57 17.78,111.12 17.78,98.42 15.88,96.52 E14.8
  Bottom 0.406: v29.84,123.19 62.87,123.19 64.77,121.28 66.04,121.28 66.67,120.65 95.89,120.65 97.16,119.38 | 97.16,119.38 R6.1 | 97.16,119.38 96.52,119.38 R5.2
N$69
  Bottom 0.406: R9.2 111.76,111.76 U$2.AF2
N$70  (via drill 0.81)
  Top 0.406: v35.56,29.84 34.92,30.48 34.92,37.47 33.66,38.73 33.66,51.44 35.56,53.34 35.56,88.9 33.02,91.44 8/5H.3 33.02,96.52 34.29,97.79 v34.29,104.78
  Bottom 0.406: E13.10 38.1,92.08 36.2,93.98 8/5H.3 | v35.56,29.84 38.1,29.84 38.73,29.21 40.01,29.21 42.55,31.75 48.9,31.75 51.44,29.21 56.52,29.21 59.05,26.67 64.77,26.67 64.77,20.95 66.67,19.05 67.94,19.05 71.75,15.24 E12.13 | v34.29,104.78 31.11,107.95 22.23,107.95 18.41,111.76 E2.12
N$71  (via drill 0.81)
  Top 0.406: v90.17,118.11 93.98,114.3 93.98,111.12 96.52,108.58 R13.1
  Bottom 0.406: v90.17,118.11 66.67,118.11 65.41,119.38 E6.9 | R14.1 102.87,108.58 100.97,106.68 R13.1
N$72
  Bottom 0.406: R5.1 107.31,116.84 107.95,117.47 111.76,117.47 U$2.AD2
N$73  (via drill 0.81)
  Top 0.406: v28.57,34.29 29.84,34.29 29.84,34.92 30.48,35.56 | 30.48,35.56 31.75,35.56 32.38,34.92 32.38,31.75 30.48,29.84 30.48,28.57 31.75,27.3 31.75,25.4 | 31.75,25.4 31.75,17.14 37.47,11.43 38.73,11.43 39.37,12.06 39.37,14.61 38.73,15.24 E15.13 | 30.48,35.56 v30.48,60.33 | v34.92,26.67 33.66,25.4 31.75,25.4
  Bottom 0.406: E4.2 64.77,15.24 62.23,17.78 E4.12 59.69,18.41 59.05,19.05 44.45,19.05 43.18,20.32 43.18,20.95 40.64,23.5 40.64,26.67 v34.92,26.67 | v28.57,34.29 17.14,34.29 16.51,33.66 TP5.1 | v30.48,60.33 20.32,60.33 20.32,80.64 22.86,83.19 E14.2
N$74  (via drill 0.81)
  Top 0.406: v44.45,125.73 44.45,121.28 45.09,120.65 45.72,120.65 E5.6
  Bottom 0.406: v44.45,125.73 25.4,125.73 23.5,127.64 17.14,127.64 15.24,125.73 E2.8
N$75  (via drill 0.81)
  Top 0.406: E15.1 45.09,12.7 44.45,13.34 44.45,22.23 45.09,22.86 E15.5 46.35,22.86 46.99,23.5 46.99,28.57 45.72,29.84 E18.1 45.09,35.56 44.45,36.2 44.45,45.09 45.09,45.72 E18.5 | v31.11,34.29 29.84,33.02 24.13,33.02 23.5,33.66 23.5,34.92 E3.1 | v102.87,1.27 102.87,18.41 102.23,19.05 93.34,19.05 92.71,18.41 85.09,18.41 84.45,19.05 84.45,20.32 E12.4
  Bottom 0.406: v31.11,34.29 40.64,34.29 41.91,35.56 E18.1 | v102.87,1.27 13.97,1.27 12.06,3.17 11.43,3.17 10.16,4.45 10.16,22.23 11.43,23.5 11.43,36.83 15.88,36.83 17.14,35.56 E3.1
N$76
  Bottom 0.406: 1.5|2.0-1.0.2 E4.9
N$77
  Bottom 0.406: R4.1 20.95,7.62 18.41,5.08 R3.2 13.97,23.5 15.24,24.77 E17.9
N$78  (via drill 0.81)
  Top 0.406: v71.75,2.54 70.48,1.27 28.57,1.27 24.77,5.08 R3.1
  Bottom 0.406: v71.75,2.54 105.41,2.54 106.68,3.81 111.76,3.81 U$2.BV2
N$79
  Top 0.406: E17.3 29.21,17.78 40.01,6.99 44.45,6.99 56.52,19.05 68.58,19.05 68.58,23.5 67.94,24.13 59.69,24.13 E4.10
N$80  (via drill 0.81)
  Top 0.406: 46.99,37.47 46.99,29.84 48.26,28.57 48.26,23.5 47.62,22.86 47.62,17.78 45.72,15.88 E15.2 45.72,14.61 46.99,13.34 46.99,12.06 46.35,11.43 45.09,11.43 43.18,13.34 43.18,23.5 45.09,25.4 E15.6 | 46.99,37.47 46.35,38.1 E18.2 | 46.99,37.47 46.99,46.35 45.72,47.62 E18.6 | E17.8 15.88,27.94 17.78,29.84 v17.78,38.1 17.78,53.98 16.51,55.24 16.51,78.11 17.14,78.74 17.14,91.44 15.88,92.71 15.88,93.98 E14.9 | v27.94,40.64 26.67,40.64 24.13,38.1 E3.2
  Bottom 0.406: v17.78,38.1 E3.2 | v27.94,40.64 36.2,40.64 37.47,39.37 40.01,39.37 41.27,38.1 E18.2
N$81
  Bottom 0.406: 41.27,41.91 43.81,41.91 45.09,40.64 E18.3 | 38.73,44.45 38.1,45.09 E18.10 | 41.27,41.91 38.73,44.45 | 41.27,41.91 26.67,41.91 1.0|2.0.2 | 38.73,44.45 48.9,44.45 50.16,45.72 1.5.1
N$82
  Bottom 0.406: E18.12 43.81,40.64 45.09,39.37 46.35,39.37 50.16,35.56 1.5.2 1.5|2.0-1.0.1
N$83  (via drill 0.81)
  Top 0.406: v33.02,19.68 36.2,22.86 E15.10
  Bottom 0.406: v33.02,19.68 32.38,20.32 E17.4
N$84  (via drill 0.81)
  Top 0.406: v14.61,2.54 7.62,9.53 7.62,53.34 10.16,55.88 10.16,84.45 14.61,88.9 E14.11
  Bottom 0.406: v14.61,2.54 18.41,2.54 19.68,3.81 34.92,3.81 38.1,6.99 41.27,6.99 42.55,8.26 69.85,8.26 71.12,9.53 71.12,10.79 70.48,11.43 66.04,11.43 62.23,15.24 E4.13
N$85
  Top 0.406: R8.1 22.86,75.56 24.13,76.83 24.13,97.16 22.86,98.42 E2.1
  Bottom 0.406: E2.1 C20.2
N$86  (via drill 0.81)
  Top 0.406: v25.4,78.11 25.4,97.16 24.13,98.42 24.13,108.58 | 24.13,108.58 24.13,111.12 23.5,111.76 E2.3 | 24.13,108.58 29.21,108.58 31.11,106.68 31.11,105.41 C19.2
  Bottom 0.406: v25.4,78.11 22.86,78.11 R7.1
N$87
  Bottom 0.406: E14.4 22.86,89.53 24.13,90.81 24.13,92.71 22.23,92.71 19.68,95.25 19.68,101.6 C20.1
N$88
  Bottom 0.406: E14.1 23.5,81.28 25.4,79.38 55.24,79.38 55.88,78.74 59.05,78.74 64.77,84.45 64.77,88.9 65.41,88.9 66.04,89.53 66.04,92.08 64.77,93.34 64.77,100.33 50.16,100.33 48.9,101.6 45.72,101.6 45.09,102.23 42.55,102.23 40.64,100.33 C19.1
N$89
  Top 0.406: E17.12 15.88,17.78 22.23,24.13 26.04,24.13 26.67,24.77 1.0|2.0.1
N$90  (via drill 0.81)
  Top 0.406: v19.05,54.61 19.05,29.84 17.14,27.94 17.14,20.32 15.88,19.05 14.61,19.05 13.97,18.41 13.97,17.14 15.24,15.88 E17.13
  Bottom 0.406: v19.05,54.61 40.01,54.61 40.64,53.98 40.64,52.7 40.01,52.07 38.73,52.07 38.1,51.44 E18.8
N$91
  Bottom 0.406: 13.97,92.71 13.97,100.97 TP3.1 | 13.97,92.71 13.97,90.81 14.61,90.17 16.51,90.17 16.51,83.19 15.88,82.55 11.43,82.55 11.43,45.09 15.24,41.27 E3.12 | 13.97,92.71 20.95,92.71 22.23,91.44 E14.5
N$92  (via drill 0.81)
  Top 0.406: E5.7 46.35,121.92 46.99,121.28 46.99,118.75 48.9,116.84 48.9,109.22 49.53,108.58 v49.53,105.41 v49.53,97.79
  Bottom 0.406: v49.53,105.41 41.91,105.41 40.64,106.68 E5.14 | v49.53,97.79 56.52,97.79 59.69,94.61 E7.9
N$93  (via drill 0.81)
  Top 0.406: v40.64,8.26 40.64,18.41 39.37,19.68 39.37,20.95 45.09,26.67 45.72,26.67 E15.7
  Bottom 0.406: v40.64,8.26 27.94,8.26 26.04,6.35 20.95,6.35 18.41,3.81 12.7,3.81 12.06,4.45 11.43,4.45 11.43,22.23 13.97,24.77 13.97,26.04 14.61,26.67 15.88,26.67 16.51,26.04 16.51,24.77 15.24,23.5 E17.10
N$94
  Bottom 0.406: E14.12 15.24,87 11.43,90.81 11.43,113.03 24.77,113.03 26.67,114.94 TP4.1 29.21,114.94 33.66,110.49 37.47,110.49 38.1,111.12 E5.12
N$95
  Top 0.406: E17.11 15.24,20.95 12.7,23.5 12.7,33.66 14.61,35.56 E3.14 15.24,36.2 13.97,37.47 13.97,81.92 15.24,83.19 E14.13
  Bottom 0.406: E14.13 11.43,83.82 10.16,82.55 10.16,39.37 20.95,39.37 22.23,40.64 E3.3
N$96
  Top 0.406: E12.12 71.12,17.78 71.12,4.45 71.75,3.81 100.97,3.81 100.97,15.24 E1.1
RRUN
  Bottom 0.406: Q12.3 103.5,36.83 109.86,30.48 111.76,30.48 U$2.BL2
STROBEF
  Bottom 0.406: Q2.3 99.69,101.6 100.97,100.33 104.78,100.33 111.12,93.98 111.76,93.98 U$2.AN2
VCC  (via drill 0.81)
  Top 0.813: v60.33,6.99 59.69,7.62 E4.14 | C12.1 77.47,28.57 78.11,27.94 78.11,13.97 76.83,12.7 E12.14 75.56,12.7 74.93,13.34 74.93,14.61 74.3,15.24 73.03,15.24 72.39,14.61 v72.39,5.08 | v20.32,26.67 20.32,27.3 23.5,30.48 23.5,31.75 22.23,33.02 22.23,34.29 20.95,35.56 20.95,40.64 22.23,41.91 22.23,43.18 E3.4 | C11.1 44.45,80.64 43.81,81.28 43.81,86.36 45.09,87.63 45.09,88.9 E13.4 | C15.1 44.45,34.29 42.55,36.2 v42.55,43.18 42.55,49.53 44.45,51.44 C18.1 | v49.53,78.11 49.53,74.93 48.26,73.66 48.26,69.22 46.35,67.31 E11.4 | R8.2 12.06,55.88 8.89,52.7 8.89,21.59 11.43,19.05 11.43,12.7 13.34,10.79 13.34,8.89 14.61,7.62 R4.2 15.88,7.62 16.51,6.99 16.51,6.35 v20.32,2.54 | 11.43,92.71 v12.7,91.44 | 11.43,92.71 11.43,118.11 12.06,118.75 12.06,121.28 15.24,124.46 C2.1 | v66.04,105.41 C7.1 67.31,99.06 69.85,96.52 69.85,90.81 | 69.85,90.81 67.94,88.9 E7.4 | 69.85,90.81 69.85,69.22 67.94,67.31 E9.4 | v87.63,109.22 87.63,104.78 85.09,102.23 85.09,83.82 84.45,83.19 84.45,41.91 87.63,38.73 88.27,38.73 93.98,33.02 C1.1 | v17.14,6.35 16.51,5.71 16.51,2.54 15.24,1.27 13.34,1.27 13.34,1.91 6.35,8.89 6.35,53.98 8.89,56.52 8.89,85.09 11.43,87.63 11.43,92.71
  Bottom 0.813: v60.33,6.99 70.48,6.99 72.39,8.89 72.39,10.16 | 72.39,10.16 72.39,12.7 E12.14 | R12.2 v72.39,5.08 69.85,2.54 v20.32,2.54 | 72.39,10.16 R2.2 92.71,10.16 92.71,13.34 93.98,14.61 E1.14 | 17.78,26.67 17.78,12.7 E17.14 R4.2 15.24,6.99 15.88,6.35 v17.14,6.35 | 17.78,26.67 17.78,28.57 16.51,29.84 C17.1 | 17.78,26.67 v20.32,26.67 | E14.14 15.24,80.64 12.7,78.11 R7.2 12.7,59.05 | E3.10 15.24,46.35 16.51,47.62 17.14,47.62 18.41,48.9 18.41,53.34 C3.1 14.61,53.34 12.7,55.24 R8.2 12.7,59.05 | C4.1 60.96,34.92 59.69,34.92 E10.14 57.15,35.56 54.61,38.1 50.8,38.1 48.26,40.64 47.62,40.64 45.72,42.55 E18.4 v42.55,43.18 | C13.1 47.62,99.06 48.26,98.42 48.26,88.9 E13.4 | C15.1 44.45,29.84 41.91,27.3 41.91,24.13 44.45,21.59 45.09,21.59 45.72,20.95 E15.4 | 56.52,53.34 C18.1 41.91,53.34 41.91,54.61 40.64,55.88 33.66,55.88 30.48,59.05 12.7,59.05 | 56.52,53.34 C10.1 | 56.52,53.34 48.9,60.96 48.9,63.5 45.72,66.67 E11.4 | v49.53,78.11 44.45,78.11 C11.1 | 15.88,104.14 15.24,104.78 E2.14 | 15.88,104.14 17.14,104.14 18.41,102.87 18.41,99.06 C14.1 | 28.57,124.46 24.77,124.46 22.86,126.36 17.78,126.36 16.51,125.09 C2.1 | 28.57,124.46 C6.1 63.5,124.46 65.41,126.36 66.04,126.36 66.67,125.73 73.66,125.73 74.3,125.09 78.74,125.09 C8.1 | 15.88,104.14 13.97,104.14 12.7,102.87 v12.7,91.44 | C9.1 66.04,76.83 64.14,74.93 64.14,67.31 E9.4 | 96.52,104.78 111.76,104.78 U$2.AJ2 | 96.52,104.78 92.71,108.58 R14.2 90.17,109.22 | 90.17,109.22 R10.2 91.44,114.3 R6.2 | 90.17,109.22 v87.63,109.22 | 96.52,104.78 85.09,104.78 83.82,106.05 81.92,106.05 81.28,106.68 E8.14 72.39,106.68 71.12,105.41 67.94,105.41 67.31,104.78 66.67,105.41 v66.04,105.41 65.41,105.41 64.14,106.68 E6.14 54.61,106.68 53.34,107.95 48.9,107.95 45.72,111.12 E5.3 E5.4 40.01,114.3 38.1,116.2 E5.10 C5.1 34.29,116.84 28.57,122.56 28.57,124.46

### Text on the board
Bottom: TELETYPE RECEIVER W706X | 1-13